# Altium schematic sheet TopLevel.SchDoc
size A
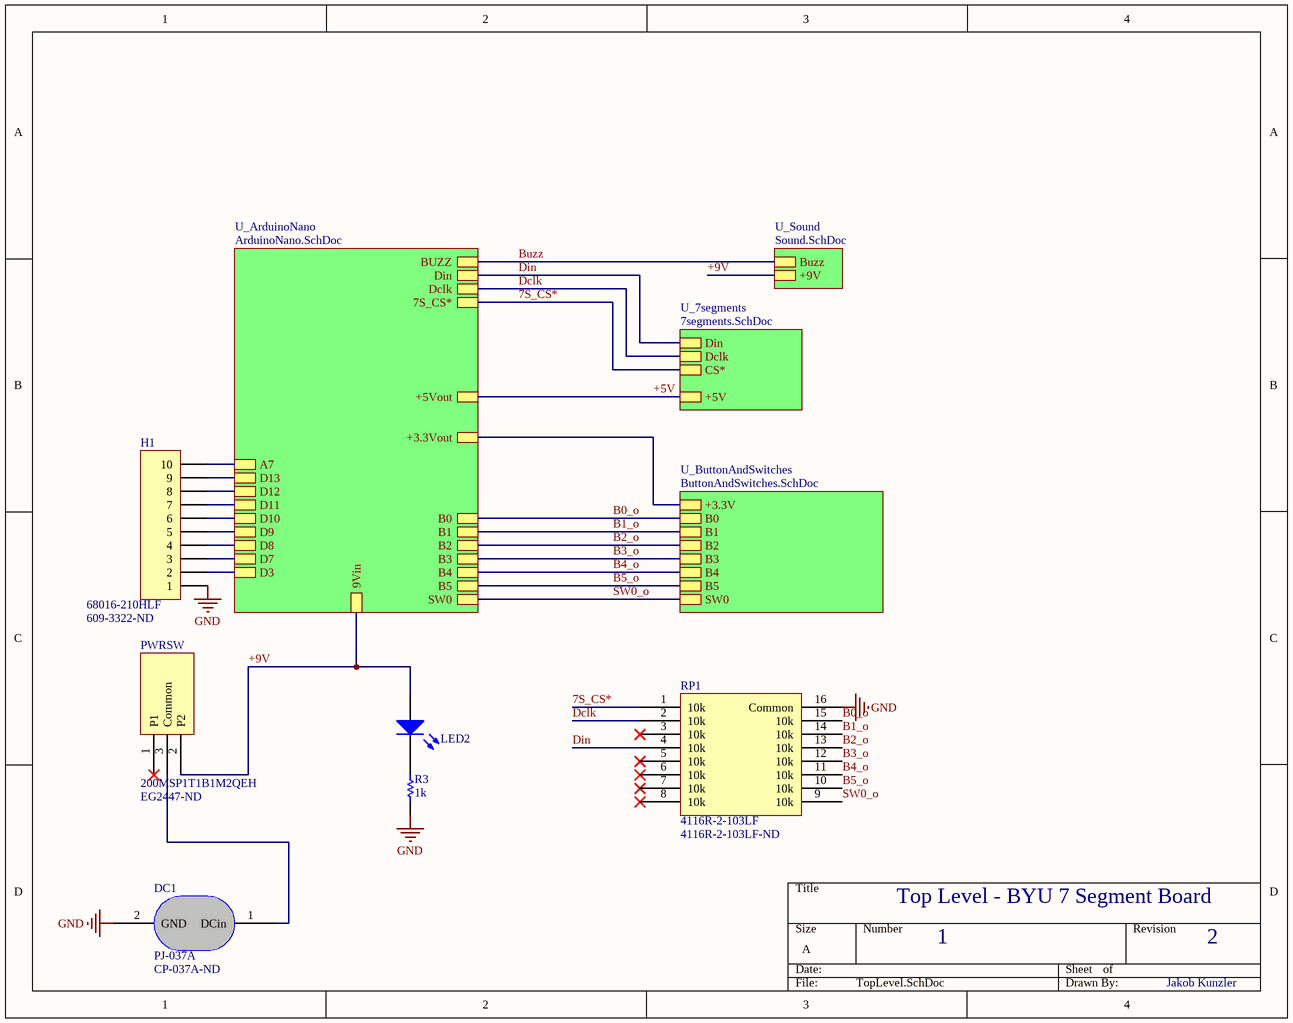
[diagram p0: TopLevel.SchDoc]

## Parts
DC1  PJ-037A  Supplier Part Number 1: CP-037A-ND  [PJ-037A]
H1  68016-210HLF  Supplier Part Number 1: 609-3322-ND  [Header1X10]
LED2  LTL-4223  [LED Through]  (value not drawn)
PWRSW  200MSP1T1B1M2QEH  Supplier Part Number 1: EG2447-ND  [200MSP1T1B1M2QEH]
R3  1k  [Resistor Through Hole]
RP1  4116R-2-103LF  Supplier Part Number 1: 4116R-2-103LF-ND  [4100R]

## Sub-sheets
U_7segments = 7segments.SchDoc: Din, CS*, Dclk, +5V
U_ArduinoNano = ArduinoNano.SchDoc: Din, D3, Dclk, 7S_CS*, SW0, B5, B4, B3, B2, B1, B0, 9Vin, +5Vout, A7, D13, D12, D11, D10, D9, D8, D7, +3.3Vout, BUZZ
U_ButtonAndSwitches = ButtonAndSwitches.SchDoc: +3.3V, B0, B1, B2, B3, B4, B5, SW0
U_Sound = Sound.SchDoc: Buzz, +9V

## Nets
GND: DC1.2(GND) H1.1 R3.2 RP1.16(Common)
7S_CS*: RP1.1(10k) ; sheet U_7segments/CS*, sheet U_ArduinoNano/7S_CS*
+5V: sheet U_7segments/+5V, sheet U_ArduinoNano/+5Vout
+9V: LED2.1(A) PWRSW.2(P2) ; sheet U_Sound/+9V, sheet U_ArduinoNano/9Vin
B0_o: RP1.15(10k) ; sheet U_ButtonAndSwitches/B0, sheet U_ArduinoNano/B0
B1_o: RP1.14(10k) ; sheet U_ButtonAndSwitches/B1, sheet U_ArduinoNano/B1
B2_o: RP1.13(10k) ; sheet U_ButtonAndSwitches/B2, sheet U_ArduinoNano/B2
B3_o: RP1.12(10k) ; sheet U_ButtonAndSwitches/B3, sheet U_ArduinoNano/B3
B4_o: RP1.11(10k) ; sheet U_ButtonAndSwitches/B4, sheet U_ArduinoNano/B4
B5_o: RP1.10(10k) ; sheet U_ButtonAndSwitches/B5, sheet U_ArduinoNano/B5
Buzz: sheet U_Sound/Buzz, sheet U_ArduinoNano/BUZZ
Dclk: RP1.2(10k) ; sheet U_7segments/Dclk, sheet U_ArduinoNano/Dclk
Din: RP1.4(10k) ; sheet U_7segments/Din, sheet U_ArduinoNano/Din
SW0_o: RP1.9(10k) ; sheet U_ButtonAndSwitches/SW0, sheet U_ArduinoNano/SW0
NetDC1_1: DC1.1(DCin) PWRSW.3(Common)
NetH1_2: H1.2 ; sheet U_ArduinoNano/D3
NetH1_3: H1.3 ; sheet U_ArduinoNano/D7
NetH1_4: H1.4 ; sheet U_ArduinoNano/D8
NetH1_5: H1.5 ; sheet U_ArduinoNano/D9
NetH1_6: H1.6 ; sheet U_ArduinoNano/D10
NetH1_7: H1.7 ; sheet U_ArduinoNano/D11
NetH1_8: H1.8 ; sheet U_ArduinoNano/D12
NetH1_9: H1.9 ; sheet U_ArduinoNano/D13
NetH1_10: H1.10 ; sheet U_ArduinoNano/A7
NetLED2_2: LED2.2(K) R3.1
(unnamed): sheet U_ButtonAndSwitches/+3.3V, sheet U_ArduinoNano/+3.3Vout

Not connected (* = marked no-connect by the designer): PWRSW 1(P1)*; RP1 3(10k)* 5(10k)* 6(10k)* 7(10k)* 8(10k)*

## Notes on the sheet
- Top Level - BYU 7 Segment Board
- 1
- 2
- Jakob Kunzler

## Library data of the parts
DC1 = DCpowerBarrel: CONN PWR JACK 2X5.5MM SOLDER; ComponentLink1Description: CP-037A-ND; ComponentLink1URL: https://www.digikey.com/product-detail/en/cui-inc/PJ-037A/CP-037A-ND/1644545; Supplier 1: Digi-Key
H1 = Header 10 Right Angle 100 mil: LatestRevisionDate: 17-Jul-2002; LatestRevisionNote: Re-released for DXP Platform.; Publisher: Altium Limited; Supplier 1: Digi-Key
LED2 = LED_RED: 2 V drop 10 mA Red; ComponentLink1Description: 160-1127-ND; ComponentLink1URL: https://www.digikey.com/product-detail/en/lite-on-inc/LTL-4223/160-1127-ND/200395; Supplier 1: Digi-Key
PWRSW = PowerSwitch: SWITCH TOGGLE SPDT 3A 120V; ComponentLink1Description: EG2447-ND; ComponentLink1URL: https://www.digikey.com/product-detail/en/e-switch/200MSP1T1B1M2QEH/EG2447-ND/378916; Supplier 1: Digi-Key
R3 = Resistor_1k: CF14JT1K00; Supplier 1: Digi-Key; ComponentLink1Description: CF14JT1K00TR-ND; ComponentLink1URL: https://www.digikey.com/product-detail/en/stackpole-electronics-inc/CF14JT1K00/CF14JT1K00TR-ND/1741314
RP1 = ResistorPack15: Supplier 1: Digi-Key